# Altium schematic sheet medusa-ai-audio.SchDoc
size Legal; SheetNumber: 1; SheetTotal: 2
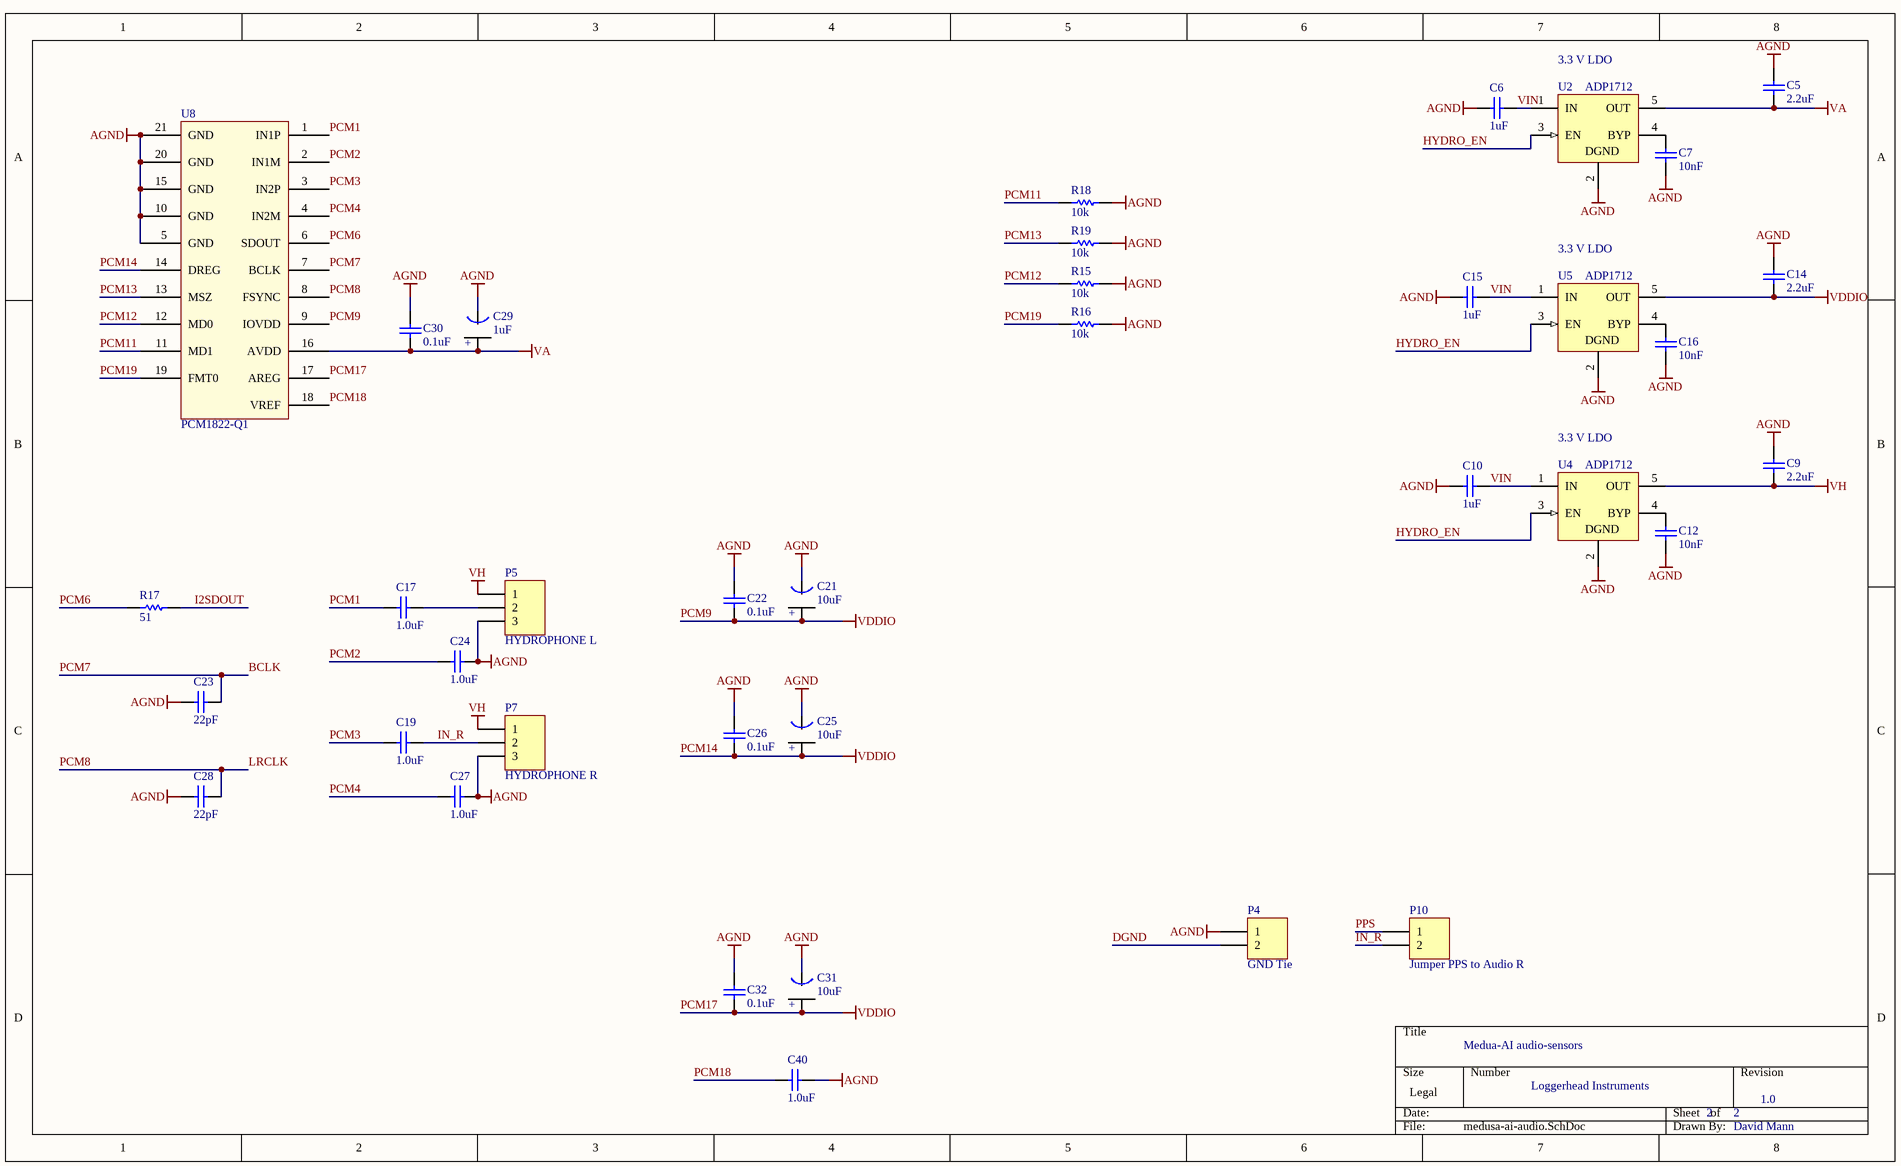
[diagram p0: medusa-ai-audio.SchDoc]

## Parts
C5  2.2uF  [0402]
C6  1uF  [0402]
C7  10nF  [0402]
C9  2.2uF  [0402]
C10  1uF  [0402]
C12  10nF  [0402]
C14  2.2uF  [0402]
C15  1uF  [0402]
C16  10nF  [0402]
C17  1.0uF  [0402]
C19  1.0uF  [0402]
C21  10uF  [Tant0805]
C22  0.1uF  [0402]
C23  22pF  [0402]
C24  1.0uF  [0402]
C25  10uF  [Tant0805]
C26  0.1uF  [0402]
C27  1.0uF  [0402]
C28  22pF  [0402]
C29  1uF  [Tant0805]
C30  0.1uF  [0402]
C31  10uF  [Tant0805]
C32  0.1uF  [0402]
C40  1.0uF  [0402]
P4  GND Tie  [HDR1X2]
P5  HYDROPHONE L  [HDR1X3]
P7  HYDROPHONE R  [HDR1X3]
P10  Jumper PPS to Audio R  [HDR1X2]
R15  10k  [3-0603]
R16  10k  [3-0603]
R17  51  [3-0603]
R18  10k  [3-0603]
R19  10k  [3-0603]
U2  ADP1712  [MF05A_N]
U4  ADP1712  [MF05A_N]
U5  ADP1712  [MF05A_N]
U8  PCM1822-Q1  [PCM1822-Q1]

## Nets
AGND: C5.2 C6.2 C7.2 C9.2 C10.2 C12.2 C14.2 C15.2 C16.2 C21.1(GND) C22.1 C23.1 C24.1 C25.1(GND) C26.1 C27.1 C28.1 C29.1(GND) C30.1 C31.1(GND) C32.1 C40.1 P4.1 P5.3 P7.3 R15.2 R16.2 R18.2 R19.2 U2.2(GND) U4.2(GND) U5.2(GND) U8.5(GND) U8.10(GND) U8.15(GND) U8.20(GND) U8.21(GND)
PCM14: C14.1 C21.2(+) C22.2 C25.2(+) C26.2 C31.2(+) C32.2 U5.5(OUT) U8.9(IOVDD) U8.14(DREG) U8.17(AREG)  [also labelled PCM17, PCM9, VDDIO]
VA: C5.1 C29.2(+) C30.2 U2.5(OUT) U8.16(AVDD)
VH: C9.1 P5.1 P7.1 U4.5(OUT)
BCLK: C23.2 U8.7(BCLK)  [also labelled PCM7]
DGND: P4.2
HYDRO_EN: U2.3(EN) U4.3(EN) U5.3(EN)
I2SDOUT: R17.2
IN_R: C19.1 P7.2 P10.2
LRCLK: C28.2 U8.8(FSYNC)  [also labelled PCM8]
PCM1: C17.2 U8.1(IN1P)
PCM2: C24.2 U8.2(IN1M)
PCM3: C19.2 U8.3(IN2P)
PCM4: C27.2 U8.4(IN2M)
PCM6: R17.1 U8.6(SDOUT)
PCM11: R18.1 U8.11(MD1)
PCM12: R15.1 U8.12(MD0)
PCM13: R19.1 U8.13(MSZ)
PCM18: C40.2 U8.18(VREF)
PCM19: R16.1 U8.19(FMT0)
PPS: P10.1
VIN: C6.1 C10.1 C15.1 U2.1(IN) U4.1(IN) U5.1(IN)
NetC7_1: C7.1 U2.4(BYP)
NetC12_1: C12.1 U4.4(BYP)
NetC16_1: C16.1 U5.4(BYP)
NetC17_1: C17.1 P5.2

## Notes on the sheet
- (near U2) 3.3 V LDO
- (near U5) 3.3 V LDO
- (near U4) 3.3 V LDO
- Medua-AI audio-sensors
- Loggerhead Instruments
- 2
- 1.0
- David Mann
- (in symbol LP3985IM5-3.3) DGND

## Library data of the parts
C5-C7 C9 C10 C12 C14-C17 C19 C23 C24 C27 C28 C40 = C0402: Ceramic Chip Capacitor - Standard; Note: Footprint corresponds to dimensions for bulk cassette packaging. This case size has tightened tolerances.; Value: 0.1uF; Published: 17-Jul-2002; LatestRevisionDate: 19-Mar-2004; LatestRevisionNote: Silkscreen size reduced.; DatasheetDocument: Mar-2001; PackageDocument: Mar-2001; PackageReference: 0402; Publisher: Altium Limited; Code_JEITA: 0402; Code_IPC: 1005 [0402]; ComponentLink1Description: Manufacturer Link; ComponentLink1URL: http://www.kemet.com/; ComponentLink2Description: Datasheet; ComponentLink2URL: http://www.kemet.com/kemet/web/homepage/kechome.nsf/vapubfilesname/F3102TA.pdf/$file/F3102TA.pdf
C21 C25 C31 = Tant0805: Value: 10uF
C22 C26 C30 C32 = C0402: Ceramic Chip Capacitor - Standard; Note: Footprint corresponds to dimensions for bulk cassette packaging. This case size has tightened tolerances.; Published: 17-Jul-2002; LatestRevisionDate: 19-Mar-2004; LatestRevisionNote: Silkscreen size reduced.; DatasheetDocument: Mar-2001; PackageDocument: Mar-2001; PackageReference: 0402; Publisher: Altium Limited; Code_JEITA: 0402; Code_IPC: 1005 [0402]; ComponentLink1Description: Manufacturer Link; ComponentLink1URL: http://www.kemet.com/; ComponentLink2Description: Datasheet; ComponentLink2URL: http://www.kemet.com/kemet/web/homepage/kechome.nsf/vapubfilesname/F3102TA.pdf/$file/F3102TA.pdf; Value: 0.1uF
C29 = Tant0805: Value: 10uF
P4 P10 = Header 2: Header, 2-Pin; LatestRevisionDate: 17-Jul-2002; LatestRevisionNote: Re-released for DXP Platform.; Publisher: Altium Limited
P5 P7 = Header 3: Header, 3-Pin; LatestRevisionDate: 17-Jul-2002; LatestRevisionNote: Re-released for DXP Platform.; Publisher: Altium Limited
R15-R19 = ERJ3RK: Precision Thick Film Chip Resistor, 10 Ohm to 1M Ohm Range, 1% and 0.5% Tolerance, 0603 Size, 0.063 W; Published: 17-Dec-2003; LatestRevisionDate: 19-Mar-2004; LatestRevisionNote: Silkscreen size reduced.; PackageDocument: Mar-2003; PackageReference: 3-0603; Publisher: Altium Limited; Code_IPC: 1608 [0603]; ComponentLink1Description: Manufacturer Link; ComponentLink1URL: http://www.panasonic.com/industrial/components/resistive_products.htm; ComponentLink2Description: Datasheet; ComponentLink2URL: http://www.panasonic.com/industrial/components/pdf/AOA0000CE2.pdf
U2 U4 U5 = LP3985IM5-3.3: Micropower, 150mA Low-Noise Ultra Low-Dropout CMOS Voltage Regulator; Manufacturer: National Semiconductor; CompType: LDO IC; PackageTopMarking: LDQB*XTT; PowerWise: N; Published: 4-Dec-2008; DatasheetVersion: Aug-2005; PackageVersion: revD, Aug-2008; PackageReference: MF05A; Publisher: Altium Limited; PackageDescription: Molded SOT-23, .115 x .063 x .040 in Body, 5 Lead, .0375 in Pitch; PartNumber: LP3985IM5-3.3; RoHS: O; PinCount: 5; DigiKeyPartNumber: LP3985IM5-3.3CT-ND; ComponentLink1Description: LP3985 Datasheet; ComponentLink1URL: http://www.national.com/ds/LP/LP3985.pdf; ComponentLink2Description: LP3985 Web Page; ComponentLink2URL: http://www.national.com/pf/LP/LP3985.html; ComponentLink3Description: MF05A Package Page; ComponentLink3URL: http://www.national.com/packaging/folders/mf05a.html
U8 = PCM1822-Q1: TI PCM1822-Q1 Stereo Channel, 32-Bit, 192-kHz, Burr-Brown Audio ADC